# Altium schematic sheet design_0.SchDoc
size 414 x 279 mm; Origin: Eagle
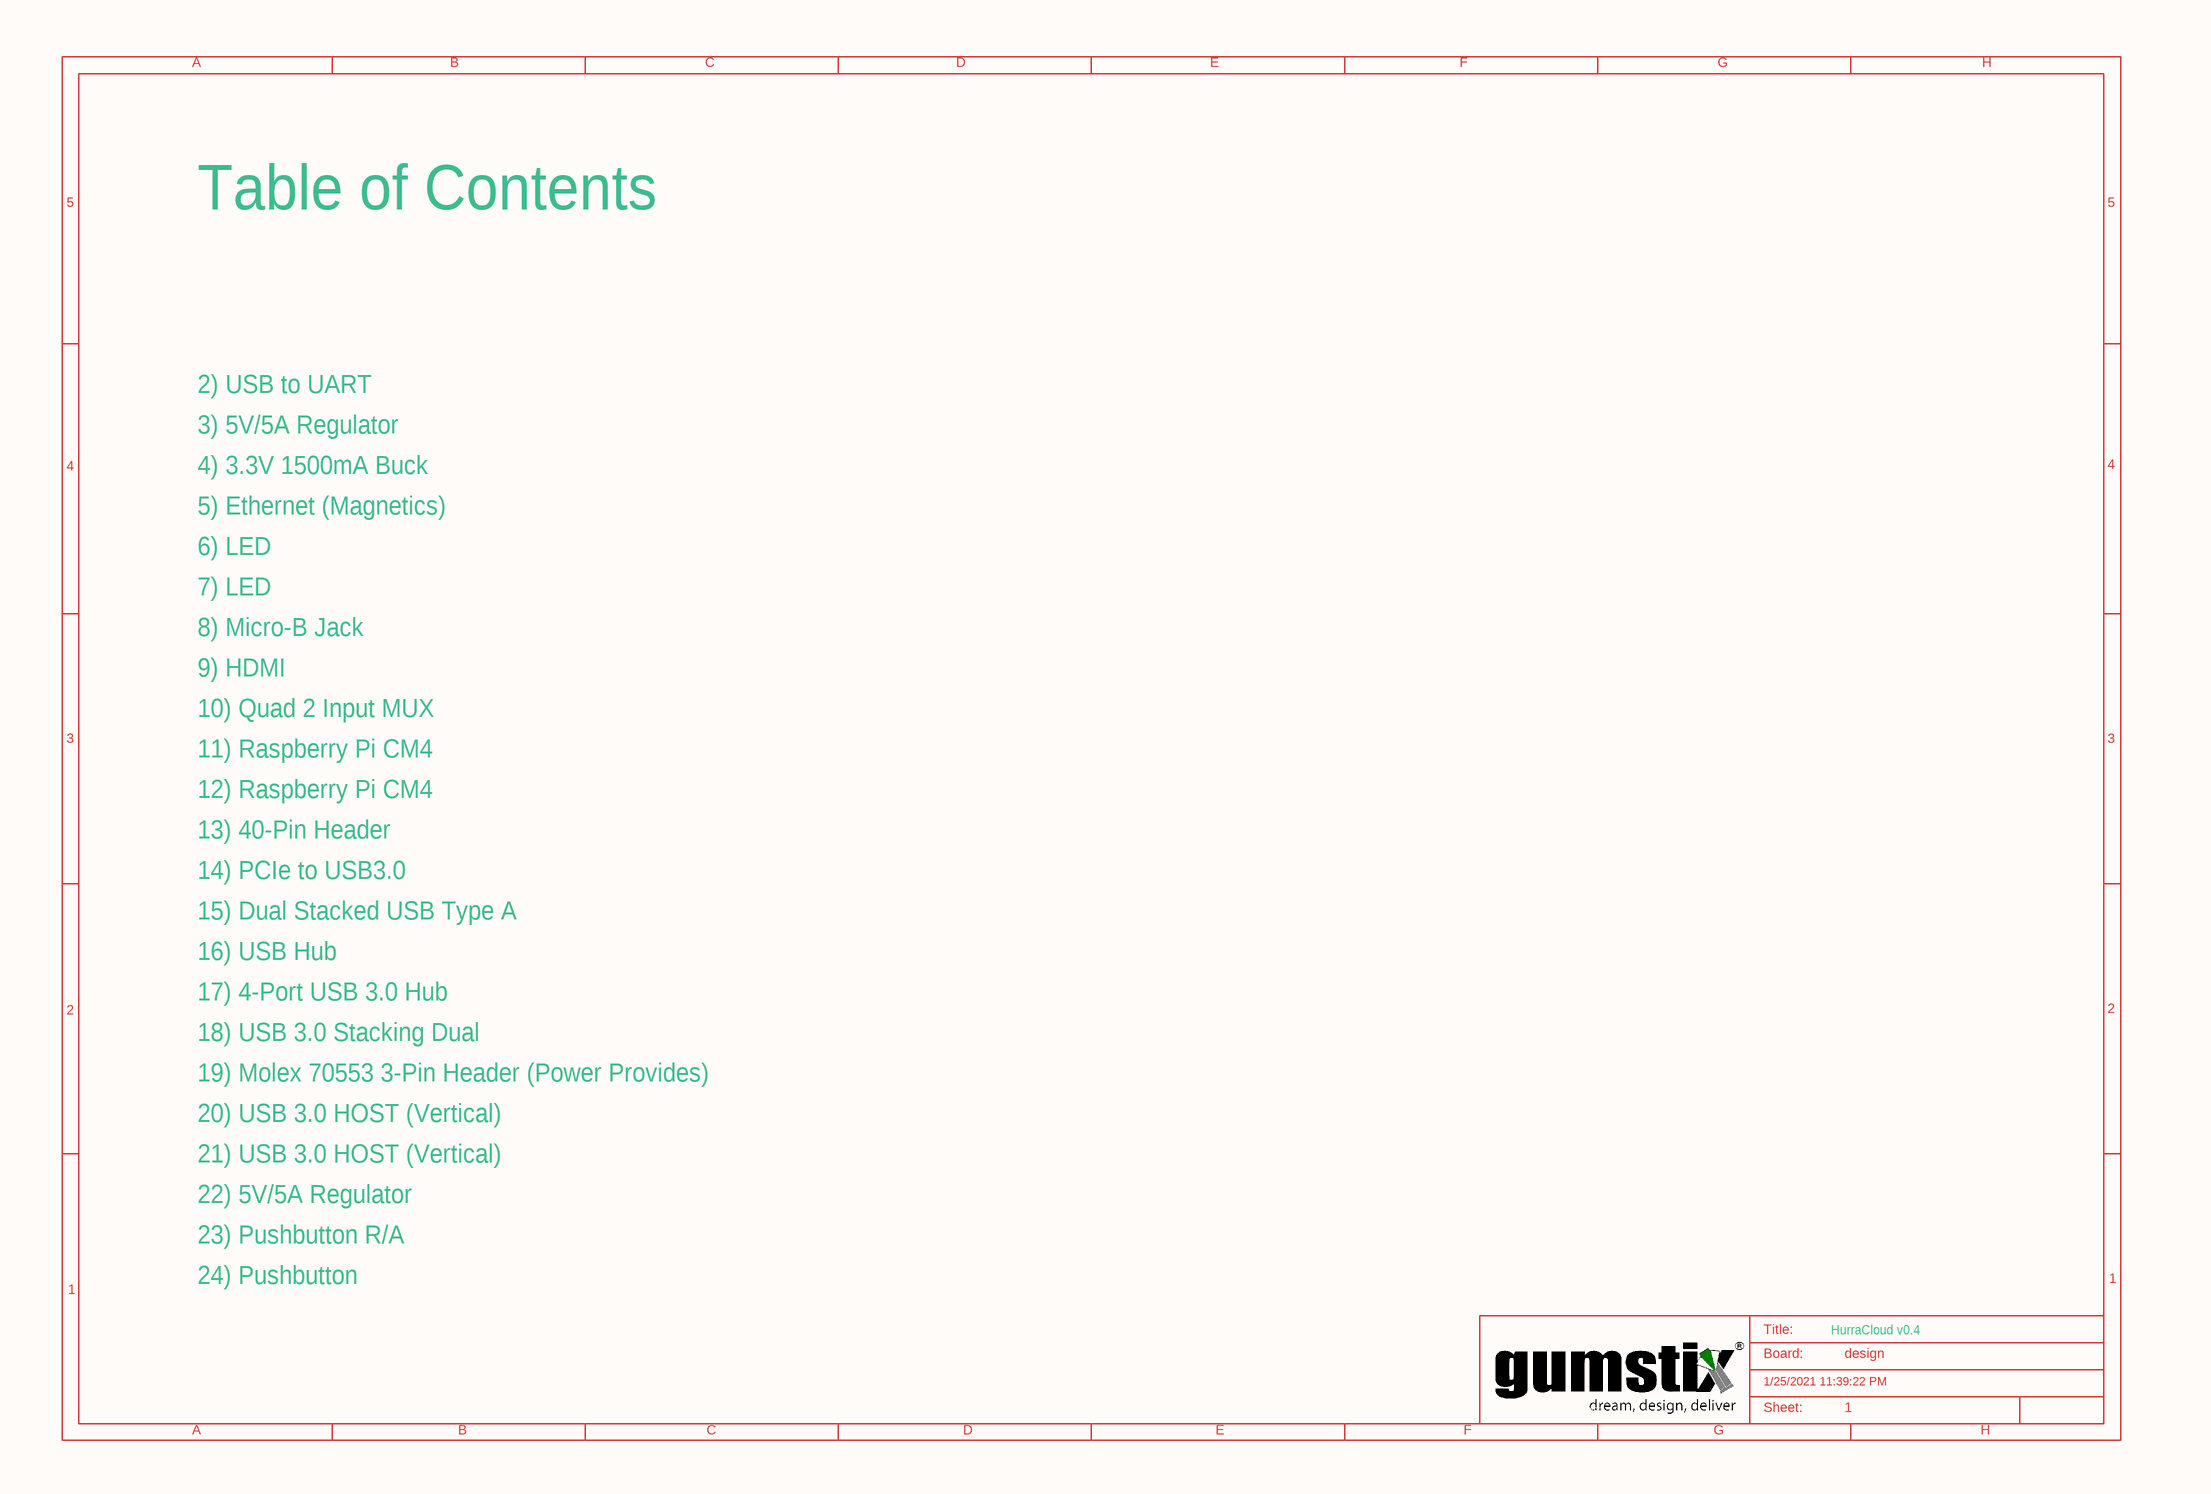
[diagram p0: design_0.SchDoc]

## Parts
TOC  DRAWING_NAME: design  LAST_DATE_TIME: 1/25/2021 11:39:22 PM  SHEET: 1  Sheet: Sheet:  Title: Title:  Board: Board:  (hidden comment: A3-L-GUMSTIX)

## Notes on the sheet
- Table of Contents
- 2) USB to UART
- 3) 5V/5A Regulator
- 4) 3.3V 1500mA Buck
- 5) Ethernet (Magnetics)
- 6) LED
- 7) LED
- 8) Micro-B Jack
- 9) HDMI
- 10) Quad 2 Input MUX
- 11) Raspberry Pi CM4
- 12) Raspberry Pi CM4
- 13) 40-Pin Header
- 14) PCIe to USB3.0
- 15) Dual Stacked USB Type A
- 16) USB Hub
- 17) 4-Port USB 3.0 Hub
- 18) USB 3.0 Stacking Dual
- 19) Molex 70553 3-Pin Header (Power Provides)
- 20) USB 3.0 HOST (Vertical)
- 21) USB 3.0 HOST (Vertical)
- 22) 5V/5A Regulator
- 23) Pushbutton R/A
- 24) Pushbutton
- HurraCloud v0.4

## Library data of the parts
TOC = A3-L-GUMSTIX: GateName_1: G$1; SymbolName_1: A3-L-GUMSTIX; LibraryName: qualified_1; DeviceSetName: A3-L-GUMSTIX; A: A; B: B; C: C; D: D; E: E; F: F; G: G; H: H; 1: 1; 2: 2; 3: 3; 4: 4; 5: 5; C:/Gumstix/gumstix-logo-16.bmp: C:/Gumstix/gumstix-logo-16.bmp